# Altium schematic sheet HIGHSPEED_v0_RADIO.SchDoc
size A3
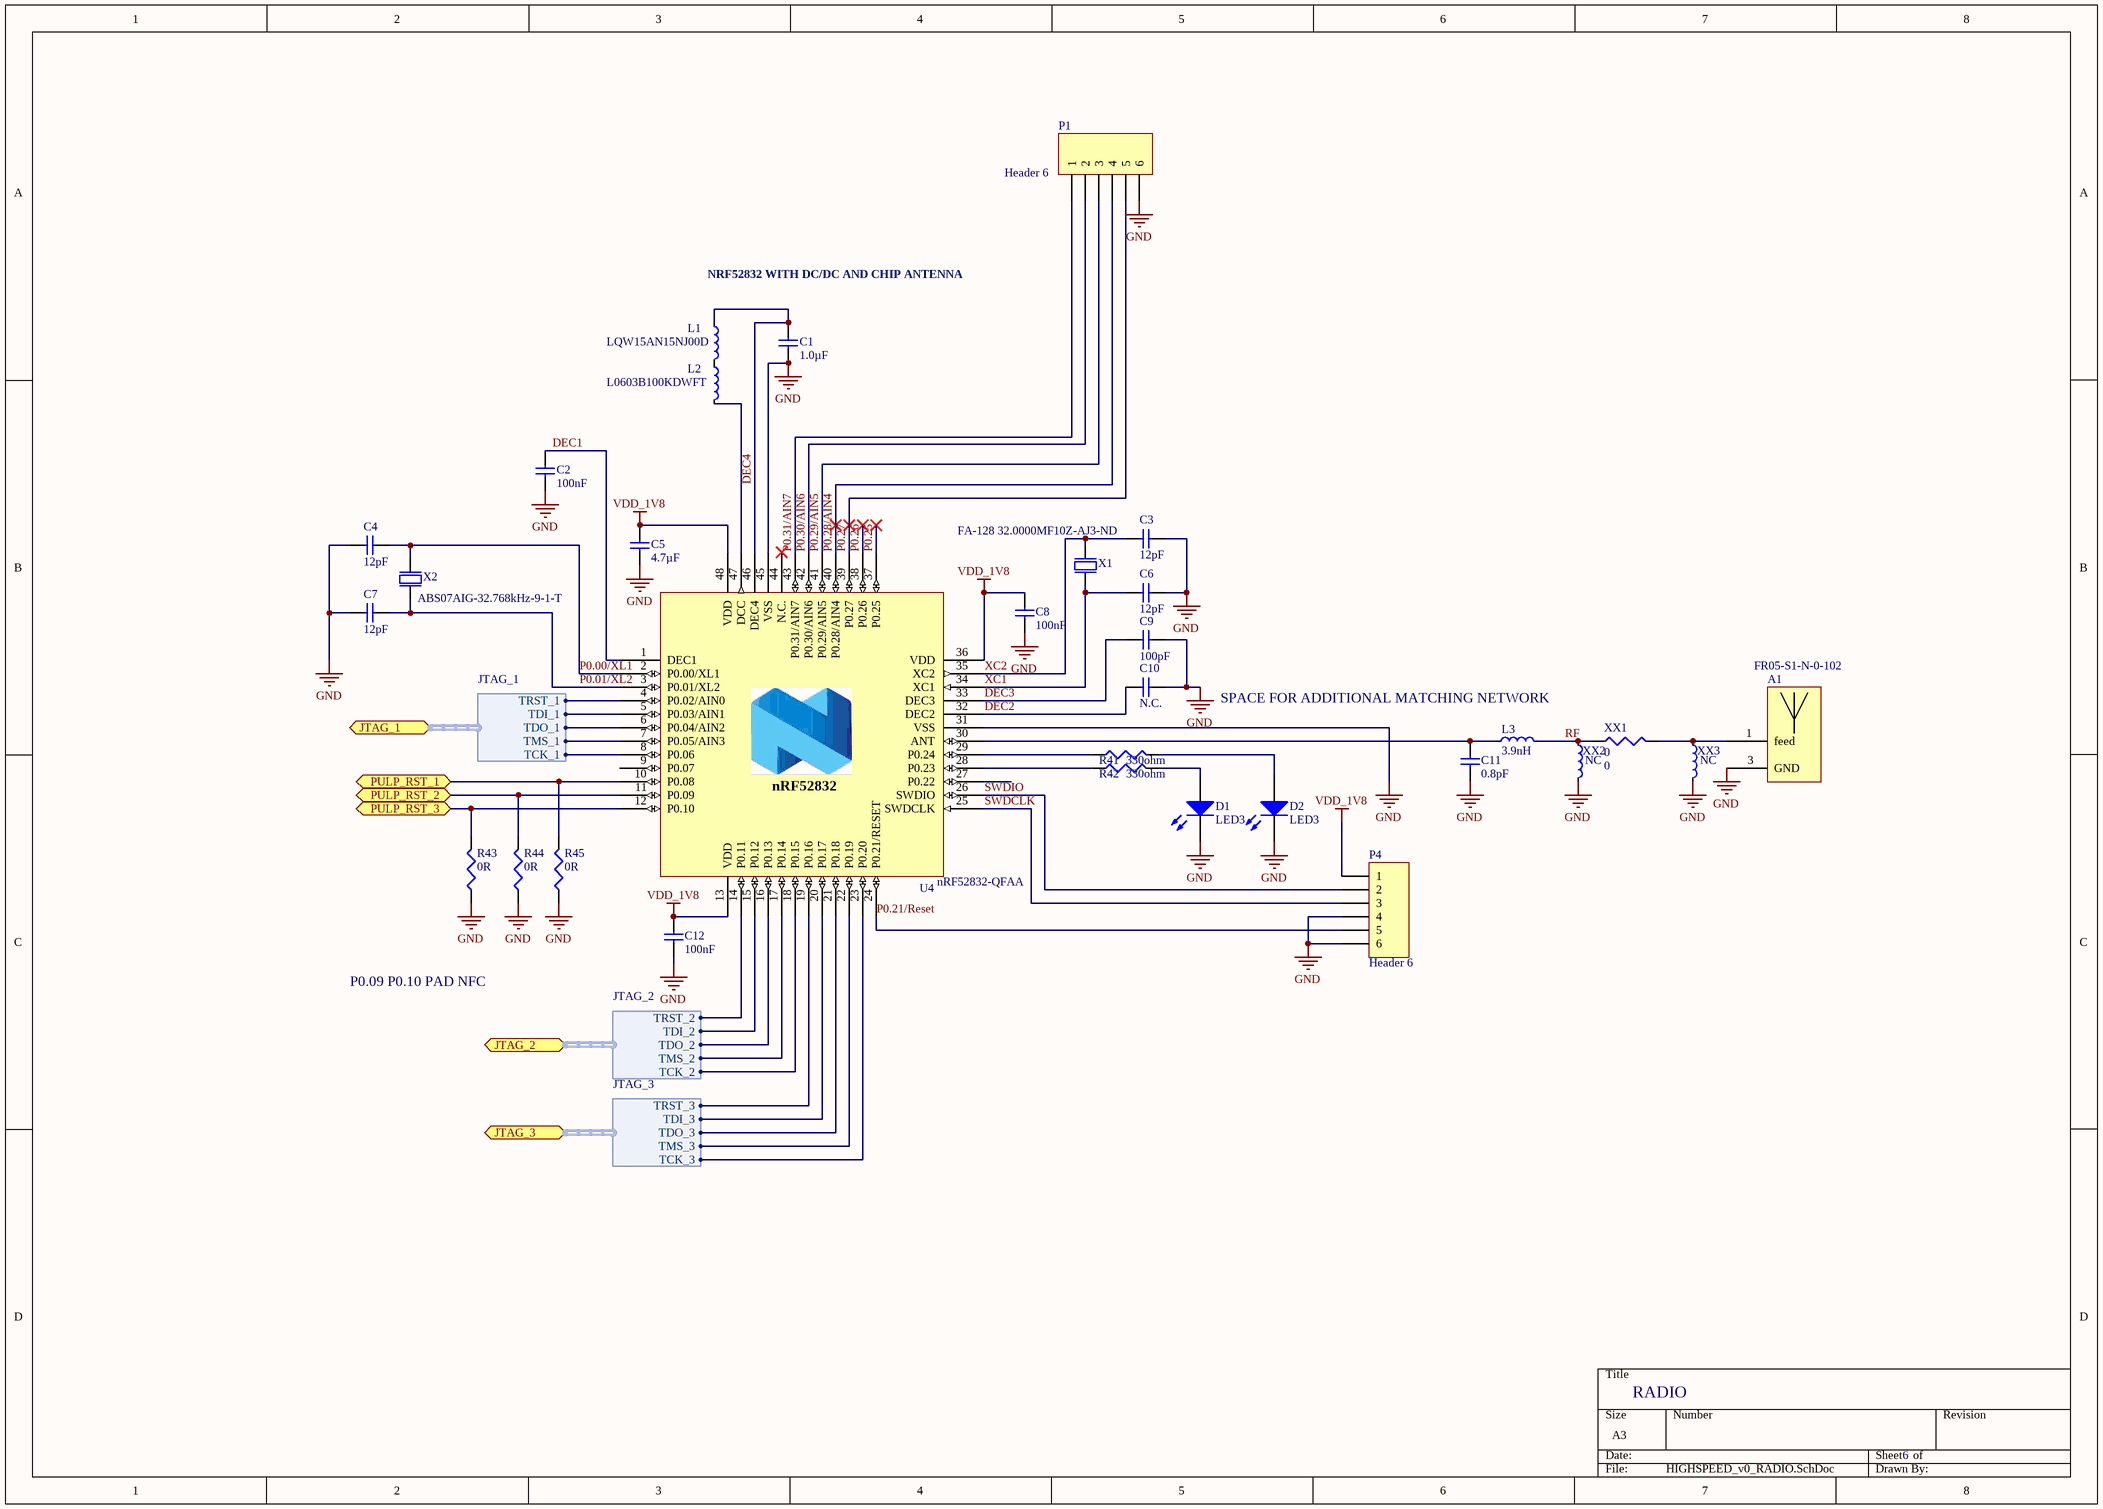
[diagram p0: HIGHSPEED_v0_RADIO.SchDoc]

## Parts
A1  FR05-S1-N-0-102  [ANTENNACHIP]
C1  1.0µF  [CAPC1608X06L]
C2  100nF  [CAPC1005X04L]
C3  12pF  [CAPC1005X04L]
C4  12pF  [CAPC1005X04L]
C5  4.7µF  [CAPC1608X06L]
C6  12pF  [CAPC1005X04L]
C7  12pF  [CAPC1005X04L]
C8  100nF  [CAPC1005X04L]
C9  100pF  [CAPC1005X04L]
C10  N.C.  [CAPC1005X04L]
C11  0.8pF  [CAPC1005X04L]
C12  100nF  [CAPC1005X04L]
D1  LED3  [0603]
D2  LED3  [0603]
L1  LQW15AN15NJ00D  [INDC1005X04L]
L2  L0603B100KDWFT  [J1-0603]
L3  3.9nH  [INDC1005X04L]
P1  Header 6  [HDR1X6]
P4  Header 6  [HDR1X6]
R41  value 330ohm  [res_0402_R - modified]  (hidden comment: Res3)
R42  value 330ohm  [res_0402_R - modified]  (hidden comment: Res3)
R43  0R  [0402]
R44  0R  [0402]
R45  0R  [0402]
U4  nRF52832-QFAA  [QFN40P600X600X90-48N]
X1  FA-128 32.0000MF10Z-AJ3-ND  [BT-XTAL_2016]
X2  ABS07AIG-32.768kHz-9-1-T  [XTAL_3215]
XX1  0  [0402]
XX2  NC  [INDC1005X04L]
XX3  NC  [INDC1005X04L]

## Ports
JTAG_1 (harness JTAG_1), JTAG_2 (harness JTAG_2), JTAG_3 (harness JTAG_3), PULP_RST_1 (bidir), PULP_RST_2 (bidir), PULP_RST_3 (bidir)

## Harnesses
JTAG_1: TRST_1, TDI_1, TDO_1, TMS_1, TCK_1
JTAG_2: TRST_2, TDI_2, TDO_2, TMS_2, TCK_2
JTAG_3: TRST_3, TDI_3, TDO_3, TMS_3, TCK_3

## Nets
GND: A1.3(GND) C1.1 C2.2 C3.2 C4.2 C5.2 C6.2 C7.2 C8.2 C9.2 C10.1 C11.1 C12.2 D1.2(K) D2.2(K) P1.6 P4.4 P4.6 R43.2 R44.2 R45.2 U4.31(VSS) U4.45(VSS) U4.49(GND) X1.2(GND) X1.4(GND) XX2.2 XX3.2
VDD_1V8: C5.1 C8.1 C12.1 P4.1 U4.13(VDD) U4.36(VDD) U4.48(VDD)
DEC1: C2.1 U4.1(DEC1)
DEC2: C10.2 U4.32(DEC2)
DEC3: C9.1 U4.33(DEC3)
DEC4: C1.2 L1.1 U4.46(DEC4)
P0.00/XL1: C4.1 U4.2(P0.00/XL1) X2.1(inp)
P0.01/XL2: C7.1 U4.3(P0.01/XL2) X2.2(out)
P0.21/Reset: P4.5 U4.24(P0.21/RESET)
P0.25: U4.37(P0.25)
P0.26: U4.38(P0.26)
P0.27: P1.5 U4.39(P0.27)
P0.28/AIN4: P1.4 U4.40(P0.28/AIN4)
P0.29/AIN5: P1.3 U4.41(P0.29/AIN5)
P0.30/AIN6: P1.2 U4.42(P0.30/AIN6)
P0.31/AIN7: P1.1 U4.43(P0.31/AIN7)
PULP_RST_1: R45.1 U4.10(P0.08) ; port PULP_RST_1
PULP_RST_2: R44.1 U4.11(P0.09) ; port PULP_RST_2
PULP_RST_3: R43.1 U4.12(P0.10) ; port PULP_RST_3
RF: L3.2 XX1.1 XX2.1
SWDCLK: P4.3 U4.25(SWDCLK)
SWDIO: P4.2 U4.26(SWDIO)
XC1: C6.1 U4.34(XC1) X1.1(inp)
XC2: C3.1 U4.35(XC2) X1.3(out)
NetA1_1: A1.1(feed) XX1.2 XX3.1
NetC11_2: C11.2 L3.1 U4.30(ANT)
NetD1_1: D1.1(A) R42.2
NetD2_1: D2.1(A) R41.2
NetL1_2: L1.2 L2.1
NetL2_2: L2.2 U4.47(DCC)
NetR41_1: R41.1 U4.29(P0.24)
NetR42_1: R42.1 U4.28(P0.23)
NetU4_4: U4.4(P0.02/AIN0) ; port JTAG_1.TRST_1
NetU4_5: U4.5(P0.03/AIN1) ; port JTAG_1.TDI_1
NetU4_6: U4.6(P0.04/AIN2) ; port JTAG_1.TDO_1
NetU4_7: U4.7(P0.05/AIN3) ; port JTAG_1.TMS_1
NetU4_8: U4.8(P0.06) ; port JTAG_1.TCK_1
NetU4_14: U4.14(P0.11) ; port JTAG_2.TRST_2
NetU4_15: U4.15(P0.12) ; port JTAG_2.TDI_2
NetU4_16: U4.16(P0.13) ; port JTAG_2.TDO_2
NetU4_17: U4.17(P0.14) ; port JTAG_2.TMS_2
NetU4_18: U4.18(P0.15) ; port JTAG_2.TCK_2
NetU4_19: U4.19(P0.16) ; port JTAG_3.TRST_3
NetU4_20: U4.20(P0.17) ; port JTAG_3.TDI_3
NetU4_21: U4.21(P0.18) ; port JTAG_3.TDO_3
NetU4_22: U4.22(P0.19) ; port JTAG_3.TMS_3
NetU4_23: U4.23(P0.20) ; port JTAG_3.TCK_3

Not connected (* = marked no-connect by the designer): A1 2(not_connected); U4 9(P0.07) 27(P0.22) 44(N.C.)*

## Notes on the sheet
- NRF52832 WITH DC/DC AND CHIP ANTENNA
- SPACE FOR ADDITIONAL MATCHING NETWORK
- P0.09 P0.10 PAD NFC
- RADIO
- 6
- (in symbol nRF52832-QFAB) nRF52832

## Library data of the parts
A1 = FR05-S1-N-0-102: Bluetooth antenna
C1 = C0603-1µ0: Capacitor, X7R, ±10%; Note: 16V; Artikkelnr Noca: 20039335; Artikkelnr Simpro: N.A.; Part Number: C0603-1µ0; Manufacturer: *; Manufacturer Part Number: *; Datasheet: *; LatestRevisionDate: 2013-06-05; Pin Count: 2; Publisher: Nordic Semiconductor; Published: 2009-05-08; Value: 1.0µF; Supplier: *; Supplier part number: *; 2nd source Supplier: *; 2nd source part number: *; Footprint Doc: 0603
C2 C8 C12 = C0402-100n: Capacitor, X7R, ±10%; Note: 16V; Artikkelnr Noca: 20039200; Artikkelnr Simpro: N.A.; Part Number: C0402-100n; Manufacturer: *; Manufacturer Part Number: *; Datasheet: *; LatestRevisionDate: 2009-11-23; Pin Count: 2; Publisher: Nordic Semiconductor; Published: 2009-05-08; Value: 100nF; Supplier: *; Supplier part number: *; 2nd source Supplier: *; 2nd source part number: *; Footprint Doc: 0402
C3 C4 C6 C7 = C0402-12p: Capacitor, NP0, ±2%; Note: 50V; Artikkelnr Noca: 20029159; Artikkelnr Simpro: N.A.; Part Number: C0402-12p; Manufacturer: *; Manufacturer Part Number: *; Datasheet: *; LatestRevisionDate: 2011-05-11; Pin Count: 2; Publisher: Nordic Semiconductor; Published: 2009-05-08; Value: 12pF; Supplier: *; Supplier part number: *; 2nd source Supplier: *; 2nd source part number: *; Footprint Doc: 0402
C5 = C0603-4µ7: Capacitor, X5R, ±10%; Note: 6.3V; Artikkelnr Noca: 20069060; Artikkelnr Simpro: N.A.; Part Number: C0603-4µ7; Manufacturer: *; Manufacturer Part Number: *; Datasheet: *; LatestRevisionDate: 2009-11-23; Pin Count: 2; Publisher: Nordic Semiconductor; Published: 2009-05-08; Value: 4.7µF; Supplier: *; Supplier part number: *; 2nd source Supplier: *; 2nd source part number: *; Footprint Doc: 0603
C9 = C0402-100p: Capacitor, NP0, ±5%; Note: 50V; Artikkelnr Noca: 20029135; Artikkelnr Simpro: N.A.; Part Number: C0402-100p; Manufacturer: *; Manufacturer Part Number: *; Datasheet: *; LatestRevisionDate: 2009-05-08; Pin Count: 2; Publisher: Nordic Semiconductor; Published: 2009-05-08; Value: 100pF; Supplier: *; Supplier part number: *; 2nd source Supplier: *; 2nd source part number: *; Footprint Doc: 0402
C10 = C0402-N.C.: Not mounted; Note: Chip Cap; Artikkelnr Noca: N.A.; Part Number: C0402-N.C.; Manufacturer: *; Manufacturer Part Number: *; Datasheet: *; LatestRevisionDate: 2009-05-08; Pin Count: 2; Publisher: Nordic Semiconductor; Published: 2009-05-08; Value: N.C.; Supplier: *; Supplier part number: *; 2nd source Supplier: *; 2nd source part number: *; Footprint Doc: 0402; Artikkelnr Simpro: N.A.
C11 = C0402-0.8p: Capacitor, NP0, ±5%; Note: 50V; Artikkelnr Noca: 20029147; Artikkelnr Simpro: N.A.; Part Number: C0402-0.8p; Manufacturer: *; Manufacturer Part Number: *; Datasheet: *; LatestRevisionDate: 2012-11-21; Pin Count: 2; Publisher: Nordic Semiconductor; Published: 2009-05-08; Value: 0.8pF; Supplier: *; Supplier part number: *; 2nd source Supplier: *; 2nd source part number: *; Footprint Doc: 0402
D1 D2 = LED3: Typical BLUE SiC LED; Published: 8-Jun-2000; LatestRevisionDate: 17-Dec-2003; LatestRevisionNote: PCB Footprint replaced.; DatasheetVersion: 16-Apr-2002; PackageVersion: 16-Apr-2002; PackageReference: 3.5X2.8X1.9; Publisher: Altium Limited; PackageDescription: SM LED; 2 C-Bend Leads; Body 3.5 x 2.8 x 1.9 mm, inc leads (LxWxH typ)
L1 = L0402-15n: High frequency chip inductor ±10%; Manufacturer: Taiyo Yuden; Manufacturer Part Number: HK100515NJ-T; 2nd source part number: 658-1328; Value: 15nH; Artikkelnr Noca: 33029323; Artikkelnr Simpro: N.A.; Part Number: L0402-15n; LatestRevisionDate: 2012-09-19; Pin Count: 2; Publisher: Nordic Semiconductor; Published: 2010-07-12; Note: High frequency chip inductor ±10%; Supplier: Digi-Key; Datasheet: http://www.yuden.co.jp/productdata/catalog/en/mlci04_e.pdf; Supplier part number: 587-1521-1-ND; 2nd source Supplier: Farnell; Footprint Doc: 0402
L2 = L0603-10µ: Chip inductor, IDC,min = 50 mA, ±20%; Manufacturer: Taiyo Yuden; Manufacturer Part Number: LBMF1608T100K; 2nd source part number: 178-6105; Value: 10µH; Note: LBMF1608T100K 10µH 80mA 0603; Artikkelnr Noca: 33029314; Artikkelnr Simpro: N.A.; Part Number: L0603-10µ; Datasheet: http://www.yuden.co.jp/ut/product/pdf/elb2_e.pdf; LatestRevisionDate: 2012-09-19; Pin Count: 2; Publisher: Nordic Semiconductor; Published: 2010-02-24; Supplier: Digi-Key; Supplier part number: 587-1714-1-ND; 2nd source Supplier: Farnell; Footprint Doc: 0603
L3 = L0402-3n9: High frequency chip inductor ±5%; Manufacturer: Murata; Manufacturer Part Number: LQP15MN3N9B02D; Artikkelnr Noca: 33029151; Artikkelnr Simpro: N.A.; Part Number: L0402-3n9; Datasheet: http://search.murata.co.jp/Ceramy/image/img/PDF/ENG/L0075S0084LQP15M.pdf; LatestRevisionDate: 2012-09-19; Pin Count: 2; Publisher: Nordic Semiconductor; Published: 2009-05-08; Value: 3.9nH; Note: High frequency chip inductor ±5%; Supplier: Digi-Key; Supplier part number: 490-1131-1-ND; 2nd source Supplier: *; 2nd source part number: *; Footprint Doc: 0402
P1 P4 = Header 6: Header, 6-Pin; LatestRevisionDate: 17-Jul-2002; LatestRevisionNote: Re-released for DXP Platform.; Publisher: Altium Limited
R41-R45 XX1 = Res3: Resistor; Published: 8-Jun-2000; LatestRevisionDate: 29-May-2009; LatestRevisionNote: IPC-7351 Footprint Added.; PackageReference: J1-0603; Publisher: Altium Limited; PackageDescription: Chip Resistor
  R43-R45: Value: 0R
  XX1: Value: 0
U4 = nRF52832-QFAB: Multi-protocol Bluetooth Low Energy, ANT and 2.4GHz proprietary system-on-chip; Manufacturer: Nordic Semiconductor; Artikkelnr Noca: N.A.; Part Number: nRF52832-QFAA; Manufacturer Part Number: nRF52832-QFAA; Datasheet: *; LatestRevisionDate: 2016-11-24; Pin Count: 48; Publisher: Nordic Semiconductor; Published: 2016-11-24; Value: nRF52832-QFAA; Note: *; Supplier: Nordic Semiconductor; Supplier part number: *; 2nd source Supplier: *; 2nd source part number: *; Footprint Doc: QFN-48; Artikkelnr Simpro: N.A.
X1 = XTAL_SMD2016_32MHz_8pF_General: XTAL SMD 2016, 32MHz, Cl=8pF, Total Tol: ±40ppm; Note: XTAL SMD 32.000MHz; Artikkelnr Noca: N.A.; Part Number: XTAL_SMD2016_32MHz_8pF_General; Manufacturer: *; Manufacturer Part Number: *; Datasheet: *; LatestRevisionDate: 2016-08-19; Pin Count: 4; Publisher: Nordic Semiconductor; Published: 2016-08-19; Value: 32MHz; Supplier: *; Supplier part number: *; 2nd source Supplier: *; 2nd source part number: *; Footprint Doc: XTAL_2016; Artikkelnr Simpro: N.A.
X2 = XTAL_SMD3215_32.768kHz_9pF_General: XTAL SMD 3215, 32.768kHz, Cl=9pF, Total Tol: ±50ppm; Note: XTAL SMD 32.768kHz; Artikkelnr Noca: N.A.; Part Number: XTAL_SMD3215_32.768kHz_9pF_General; Manufacturer: *; Manufacturer Part Number: *; Datasheet: *; LatestRevisionDate: 2016-08-19; Pin Count: 2; Publisher: Nordic Semiconductor; Published: 2016-08-19; Value: 32.768kHz; Supplier: *; Supplier part number: *; 2nd source Supplier: *; 2nd source part number: *; Footprint Doc: XTAL_3215; Artikkelnr Simpro: N.A.
XX2 XX3 = L0402-N.C.: Not mounted; Value: N.C.; Artikkelnr Noca: N.A.; Assembly: Not mounted; Part Number: L0402-N.C.; Manufacturer: *; Manufacturer Part Number: *; Datasheet: *; LatestRevisionDate: 2016-11-24; Pin Count: 2; Publisher: Nordic Semiconductor; Published: 2016-11-24; Note: *; Supplier: *; Supplier part number: *; 2nd source Supplier: *; 2nd source part number: *; Footprint Doc: 0402; Artikkelnr Simpro: N.A.; ComponentLink1Description: Datasheet; ComponentLink2Description: Supplier link